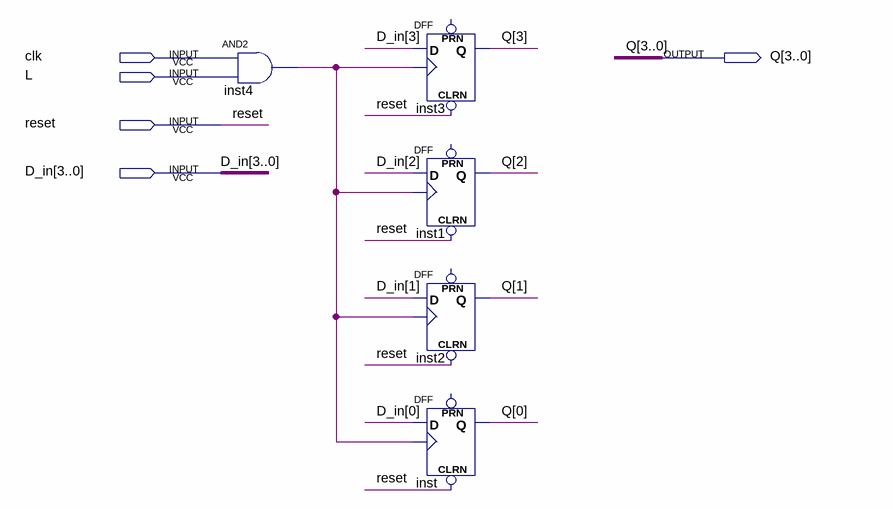
[diagram p0: schematic sheet]
// Quartus schematic reg4.bdf as structural Verilog: 5 symbols, 5 pins
module reg4 (
  input  clk,
  input  L,
  input  reset,
  input  [3:0] D_in,
  output [3:0] Q
);

  wire inst4_out;

  and inst4 (inst4_out, clk, L);
  DFF inst3 (.CLRN(reset), .CLK(inst4_out), .D(D_in[3]), .Q(Q[3]));  // open: PRN
  DFF inst1 (.CLRN(reset), .CLK(inst4_out), .D(D_in[2]), .Q(Q[2]));  // open: PRN
  DFF inst2 (.CLRN(reset), .CLK(inst4_out), .D(D_in[1]), .Q(Q[1]));  // open: PRN
  DFF inst (.CLRN(reset), .CLK(inst4_out), .D(D_in[0]), .Q(Q[0]));  // open: PRN
endmodule
